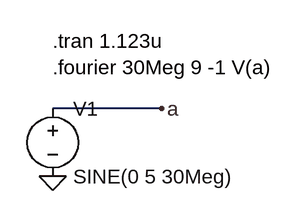
[diagram p0: schematic Fourier_30MHz.asc]
Fourier_30MHz.asc, the LTspice schematic file:
Version 4
SHEET 1 880 680
WIRE 368 160 240 160
FLAG 240 240 0
FLAG 368 160 a
SYMBOL voltage 240 144 R0
SYMATTR InstName V1
SYMATTR Value SINE(0 5 30Meg)
TEXT 240 80 Left 2 !.tran 1.123u\n.fourier 30Meg 9 -1 V(a)

The netlist it stands for:
* Fourier_30MHz.asc
V1 a 0 SINE(0 5 30Meg)
.tran 1.123u
.fourier 30Meg 9 -1 V(a)
.backanno
.end